# Altium schematic sheet 1A18J2_1A20J2 A.SchDoc: Cable Assembly
size A; Date: 1/1/17; CompanyName: National Center for Atmospheric Research; DrawnBy: Rich Erickson; Engineer: 4/21/17; Organization: Earth Observing Laboratory; Address1: 3450 Mitchell Lane; Address2: FL1; Address3: 3090 Center Green Dr.; Address4: Boulder, CO. 80301; DocumentNumber: 1A18J2_1A20J2(AC PWR, 120V); Revision: A; SheetNumber: 1; SheetTotal: 1; Department: Remote Sensing Facility; ModifiedDate: 7/17/97; ImagePath: 4/21/17; ProjectName: Ka Band; Application_BuildNumber: 5
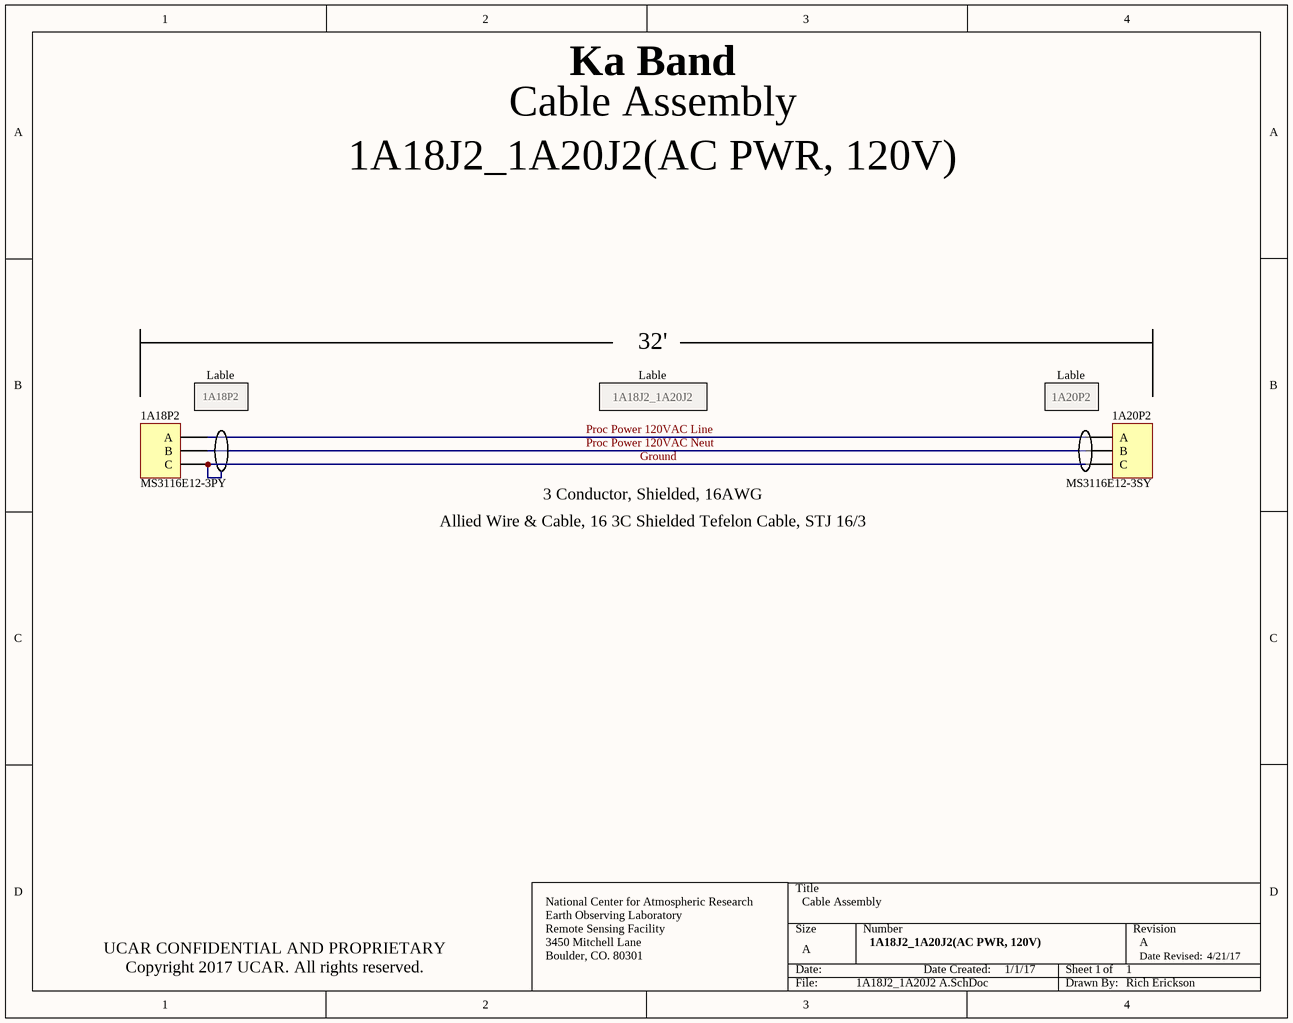
[diagram p0: 1A18J2_1A20J2 A.SchDoc]

## Parts
1A18P2  MS3116E12-3PY  [HDR1X3]
1A20P2  MS3116E12-3SY  [HDR1X3]

## Nets
Ground: 1A18P2.3(C) 1A20P2.3(C)
Proc Power 120VAC Line: 1A18P2.1(A) 1A20P2.1(A)
Proc Power 120VAC Neut: 1A18P2.2(B) 1A20P2.2(B)

## Notes on the sheet
- 32'
- (near 1A18P2) 1A18P2
- Lable
- 1A18J2_1A20J2
- (near 1A20P2) 1A20P2
- 3 Conductor, Shielded, 16AWG
- Allied Wire & Cable, 16 3C Shielded Tefelon Cable, STJ 16/3
- UCAR CONFIDENTIAL AND PROPRIETARY
  Copyright 2017 UCAR. All rights reserved.
- Date Created:
- Date Revised:

## Library data of the parts
1A18P2 1A20P2 = Header 3: Header, 3-Pin; LatestRevisionDate: 17-Jul-2002; LatestRevisionNote: Re-released for DXP Platform.; Publisher: Altium Limited